# Altium project LedThuHongNgoai.PrjPcb
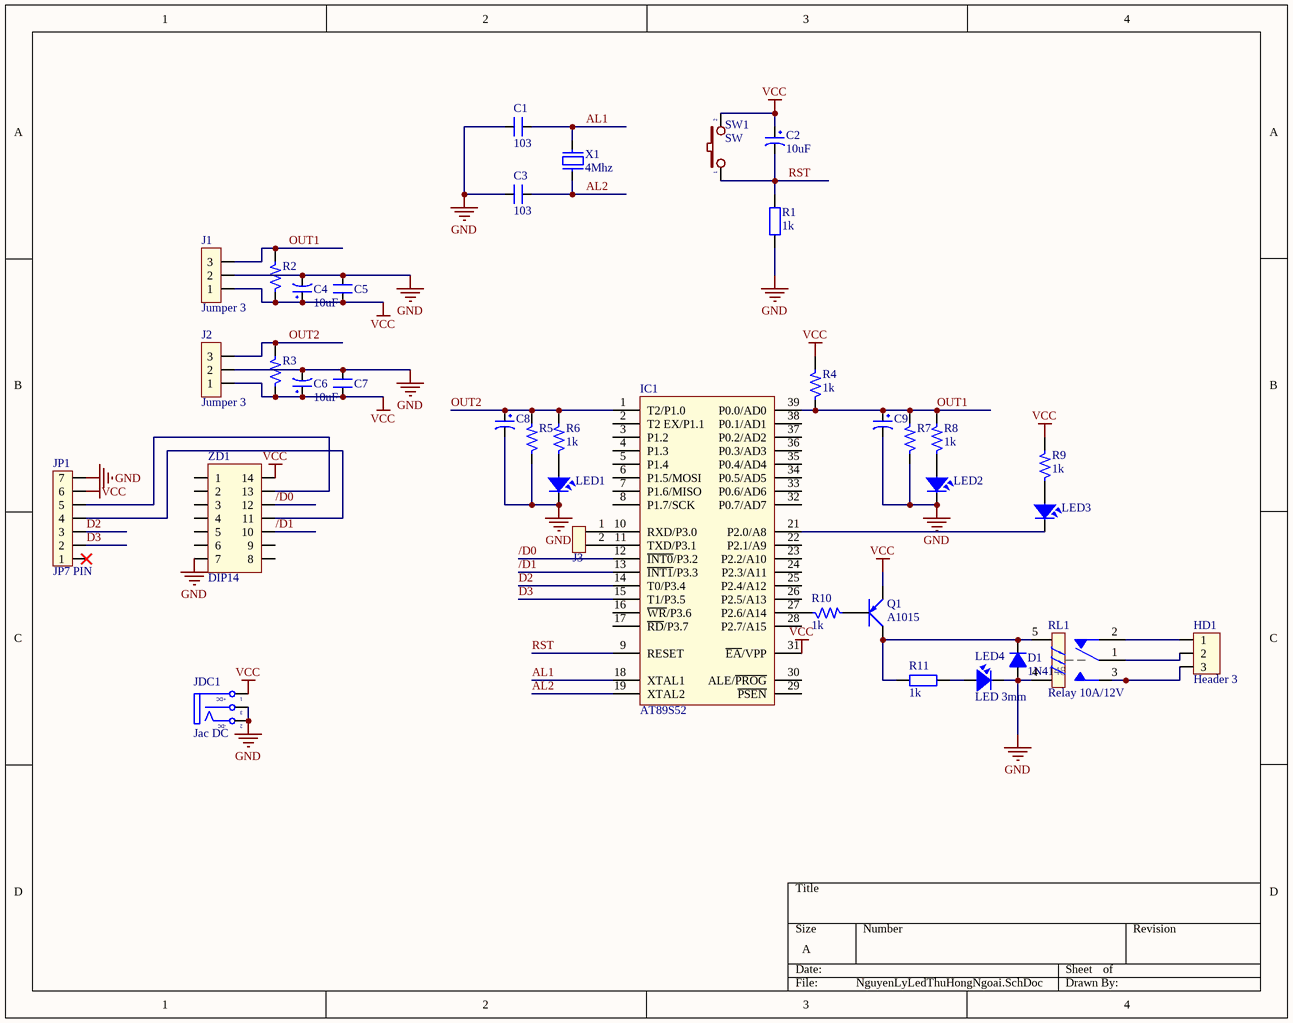
[diagram p0: NguyenLyLedThuHongNgoai.SchDoc]
1 sheet, 37 parts. Net scope: global (net labels, ports and power ports of the same name join across sheets).
Board file: PCBLedThuHongNgoai.PcbDoc

## Sheet NguyenLyLedThuHongNgoai.SchDoc
size A

### Parts
C1  103  [CN1.5]
C2  10uF  [CP1/2]
C3  103  [CN1.5]
C4  10uF  [CP1/2]
C5  103  [CN1.5]  (value not drawn)
C6  10uF  [CP1/2]
C7  103  [CN1.5]  (value not drawn)
C8  10uF  [CP1/2]  (value not drawn)
C9  10uF  [CP1/2]  (value not drawn)
D1  1N4148  [D0.5A]
HD1  Header 3  [HED3]
IC1  AT89S52  [DIP40/W0.6]
J1  Jumper 3  [JP3]
J2  Jumper 3  [JP3]
J3  Jumper 2  [JP2]  (value not drawn)
JDC1  Jac DC  [DC-IN]
JP1  JP7 PIN  [JP7]
LED1  LED  [LED-5TRED]  (value not drawn)
LED2  LED  [LED-5TRED]  (value not drawn)
LED3  LED  [LED-5TRED]  (value not drawn)
LED4  LED 3mm  [LED-5 GRe]
Q1  A1015  [TO-92]
R1  1k  [R1/2W4]
R2  1k  [R1/4W]  (value not drawn)
R3  1k  [R1/4W]  (value not drawn)
R4  1k  [R1/4W]
R5  1k  [R1/4W]  (value not drawn)
R6  1k  [R1/4W]
R7  1k  [R1/4W]  (value not drawn)
R8  1k  [R1/4W]
R9  1k  [R1/4W]
R10  1k  [R1/4W]
R11  1k  [R1/2W4]
RL1  Relay 10A/12V  [RL_SPDT_10A]
SW1  SW  [SW2]
X1  4Mhz  [XT2]
ZD1  DIP14  [DIP14/W0.3]

### Nets
GND: C1.1 C3.1 C4.2 C5.1 C6.2 C7.1 C8.2 C9.2 D1.1(A) IC1.20(GND) J1.2 J2.2 JDC1.2(TN) JDC1.3(S) JP1.7 LED1.2 LED2.2 LED4.2 R1.1 R5.1 R7.1 RL1.4 ZD1.7
VCC: C2.1 C4.1 C5.2 C6.1 C7.2 IC1.31(~{EA}/VPP) IC1.40(VCC) J1.1 J2.1 JDC1.1(T) JP1.6 Q1.1(E) R2.1 R3.1 R4.2 R9.2 SW1.2 ZD1.14
/D0: IC1.12(~{INT0}/P3.2) ZD1.12
/D1: IC1.13(~{INT1}/P3.3) ZD1.10
AL1: C1.2 IC1.18(XTAL1) X1.2
AL2: C3.2 IC1.19(XTAL2) X1.1
D2: IC1.14(T0/P3.4) JP1.3
D3: IC1.15(T1/P3.5) JP1.2
OUT1: C9.1 IC1.39(P0.0/AD0) J1.3 R2.2 R4.1 R7.2 R8.2
OUT2: C8.1 IC1.1(T2/P1.0) J2.3 R3.2 R5.2 R6.2
RST: C2.2 IC1.9(RESET) R1.2 SW1.1
NetD1_2: D1.2(K) Q1.2(C) R11.1 RL1.5
NetHD1_1: HD1.1 RL1.2
NetHD1_2: HD1.2 RL1.1
NetHD1_3: HD1.3 RL1.3
NetIC1_10: IC1.10(RXD/P3.0) J3.1
NetIC1_11: IC1.11(TXD/P3.1) J3.2
NetIC1_21: IC1.21(P2.0/A8) LED3.2
NetIC1_27: IC1.27(P2.6/A14) R10.1
NetJP1_4: JP1.4 ZD1.11
NetJP1_5: JP1.5 ZD1.13
NetLED1_1: LED1.1 R6.1
NetLED2_1: LED2.1 R8.1
NetLED3_1: LED3.1 R9.1
NetLED4_1: LED4.1 R11.2
NetQ1_3: Q1.3(B) R10.2

Not connected (* = marked no-connect by the designer): IC1 2(T2_EX/P1.1) 3(P1.2) 4(P1.3) 5(P1.4) 6(P1.5/MOSI) 7(P1.6/MISO) 8(P1.7/SCK) 16(~{WR}/P3.6) 17(~{RD}/P3.7) 22(P2.1/A9) 23(P2.2/A10) 24(P2.3/A11) 25(P2.4/A12) 26(P2.5/A13) 28(P2.7/A15) 29(~{PSEN}) 30(ALE/~{PROG}) 32(P0.7/AD7) 33(P0.6/AD6) 34(P0.5/AD5) 35(P0.4/AD4) 36(P0.3/AD3) 37(P0.2/AD2) 38(P0.1/AD1); JP1 1*; ZD1 1 2 3 4 5 6 8 9

### Notes on the sheet
- (in symbol JACK DC) +DC; -DC

### Library data of the parts
C1 C3 C5 C7 = CN1.5: Cap np 682pF => 104pF; Value: 0.01uF
C2 C4 C6 C8 C9 = CP1: Cap P  0,1uF < 22uF , 16 - 50V; Value: 10uF/50V; Description 1: 10 => 220uF/6,3V/10V - 10uF => 100uF/16V; Description 2: 0,1uF => 33uF/50V - 10uF => 22uF/63V; Description 3: 0,47uF => 10uF/100V
D1 = D0.5A: 1N4148/D 0.5A; Value: 1N4148
HD1 = Hed3: Header 3 (Green); Value: Header 3
IC1 = AT89S52: AT89S52, 8k Byte Flash Memory , 40 Pin; Value: AT89S52
J1 J2 = JP3: Value: J3
J3 = JP 2: Value: JP 2
JDC1 = JACK DC: Jac DC input; Value: Jac DC
JP1 = JP7: Value: JP7
LED1-LED3 = LED: LED Single colour Green and Red; Value: LED 3 ly Single Colour
LED4 = LED 3mm: LED Single colour Green and Red; Value: LED 3 ly Single Colour
Q1 = A1015: PNP 600mW, ECB; Value: A1015
R1 R11 = R1/4W: Resistor 1/4W; Value: R1/4W - 1K
R2-R10 = R: Resistor 1/4W; Value: R1/4W - 1K
RL1 = Relay 1: Relay SPDT,10A - 12VDC 5 Pin; Value: Relay SPDT, 10A, 12V
SW1 = SW2: Switch button 2 pin; Value: SW chip 2 pin
X1 = XT2: Crystal For all Crystal 2pin.; Value: 4Mhz
ZD1 = DIP14: Value: DIP14